# EAGLE design Shield STM32F407VET6 Mini - Reversed (EAGLE 8.2.0)
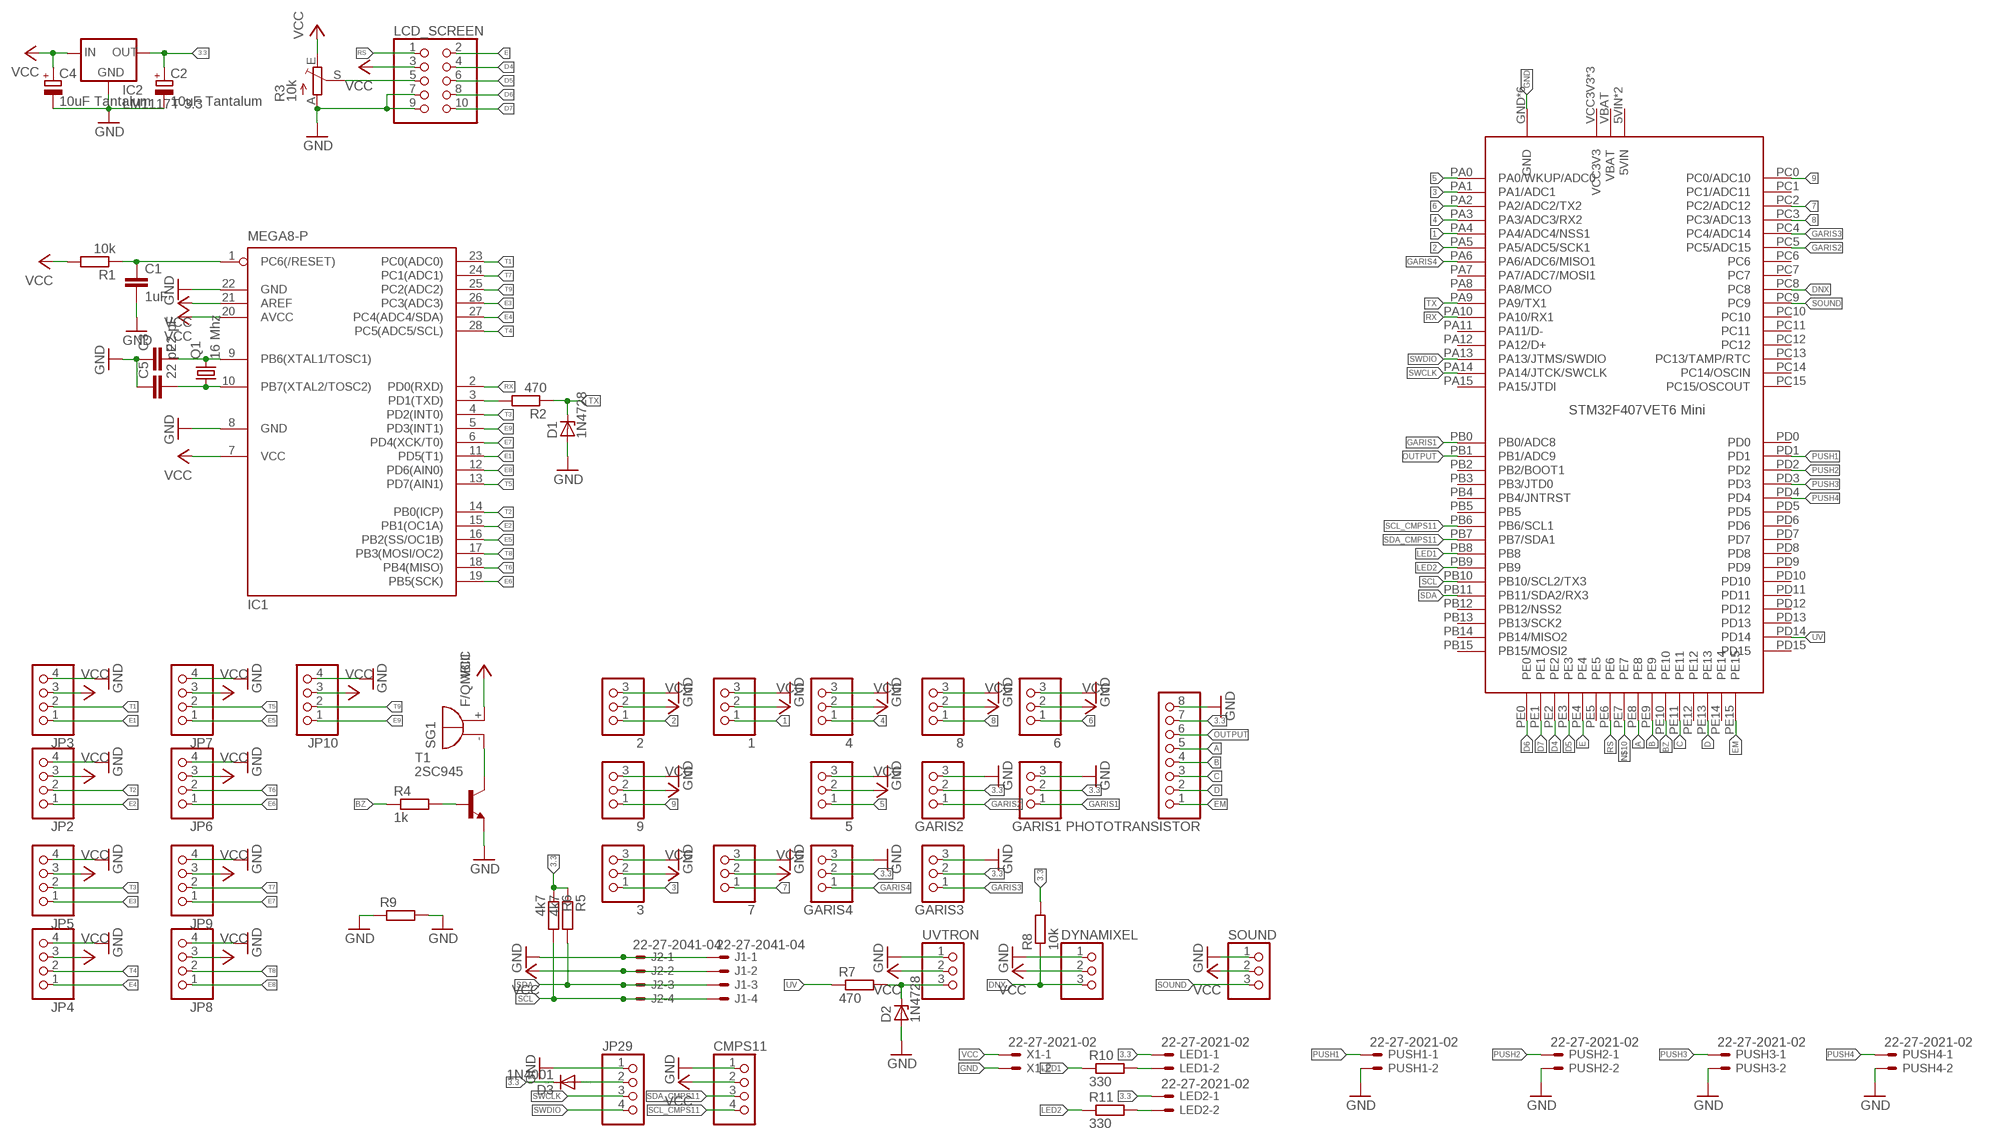
[diagram p0: schematic, sheet 1]

## Parts
1  PINHD-1X3  [1X03]
2  PINHD-1X3  [1X03]
3  PINHD-1X3  [1X03]
4  PINHD-1X3  [1X03]
5  PINHD-1X3  [1X03]
6  PINHD-1X3  [1X03]
7  PINHD-1X3  [1X03]
8  PINHD-1X3  [1X03]
9  PINHD-1X3  [1X03]
C1  1uF  C-EU025-025X050  [C025-025X050]
C2  10uF Tantalum  CPOL-EUE2.5-5  [E2,5-5]
C3  22 pF  C-EU025-025X050  [C025-025X050]
C4  10uF Tantalum  CPOL-EUE2.5-5  [E2,5-5]
C5  22 pF  C-EU025-025X050  [C025-025X050]
CMPS11  PINHD-1X4  [1X04]
D1  1N4728  ZENER-DIODEZD-7.5  [ZDIO-7.5]
D2  1N4728  ZENER-DIODEZD-7.5  [ZDIO-7.5]
D3  1N4001  BAS15  [DO34-7]
DYNAMIXEL  PINHD-1X3  [1X03]
GARIS1  PINHD-1X3  [1X03]
GARIS2  PINHD-1X3  [1X03]
GARIS3  PINHD-1X3  [1X03]
GARIS4  PINHD-1X3  [1X03]
IC1  MEGA8-P  [DIL28-3]
IC2  LM1117T-3.3  [TO220]
J1  22-27-2041-04  [6410-04]
J2  22-27-2041-04  [6410-04]
JP2  PINHD-1X4  [1X04]
JP3  PINHD-1X4  [1X04]
JP4  PINHD-1X4  [1X04]
JP5  PINHD-1X4  [1X04]
JP6  PINHD-1X4  [1X04]
JP7  PINHD-1X4  [1X04]
JP8  PINHD-1X4  [1X04]
JP9  PINHD-1X4  [1X04]
JP10  PINHD-1X4  [1X04]
JP29  PINHD-1X4  [1X04]
LCD_SCREEN  PINHD-2X5  [2X05]
LED1  22-27-2021-02  [6410-02]
LED2  22-27-2021-02  [6410-02]
PHOTOTRANSISTOR  PINHD-1X8  [1X08]
PUSH1  22-27-2021-02  [6410-02]
PUSH2  22-27-2021-02  [6410-02]
PUSH3  22-27-2021-02  [6410-02]
PUSH4  22-27-2021-02  [6410-02]
Q1  16 Mhz  CRYSTALHC49U70  [HC49U70]
R1  10k  R-EU_0204/7  [0204/7]
R2  470  R-EU_0204/7  [0204/7]
R3  10k  TRIM_EU-CA6V  [CA6V]
R4  1k  R-EU_0204/7  [0204/7]
R5  4k7  R-EU_0204/7  [0204/7]
R6  4k7  R-EU_0204/7  [0204/7]
R7  470  R-EU_0204/7  [0204/7]
R8  10k  R-EU_0204/7  [0204/7]
R9  R-EU_0204/5  [0204/5]
R10  330  R-EU_M1206  [M1206]
R11  330  R-EU_M1206  [M1206]
SG1  F/QMBIII  [F/QMBIII]
SOUND  PINHD-1X3  [1X03]
T1  2SC945  [TO92-ECB]
U$2  STM32F407VET6_MINI  [STM32F407VET6_MINI]
UVTRON  PINHD-1X3  [1X03]
X1  22-27-2021-02  [6410-02]

## Nets
1: 1.1 U$2.PA4(PA4/ADC4/NSS1)
2: 2.1 U$2.PA5(PA5/ADC5/SCK1)
3: 3.1 U$2.PA1(PA1/ADC1)
3.3: C2.+ D3.C GARIS1.2 GARIS2.2 GARIS3.2 GARIS4.2 IC2.2(OUT) LED1.1 LED2.1 PHOTOTRANSISTOR.7 R5.1 R6.1 R8.2
4: 4.1 U$2.PA3(PA3/ADC3/RX2)
5: 5.1 U$2.PA0(PA0/WKUP/ADC0)
6: 6.1 U$2.PA2(PA2/ADC2/TX2)
7: 7.1 U$2.PC2(PC2/ADC12)
8: 8.1 U$2.PC3(PC3/ADC13)
9: 9.1 U$2.PC0(PC0/ADC10)
A: PHOTOTRANSISTOR.5 U$2.PE8
B: PHOTOTRANSISTOR.4 U$2.PE9
BZ: R4.1 U$2.PE10
C: PHOTOTRANSISTOR.3 U$2.PE11
D: PHOTOTRANSISTOR.2 U$2.PE13
D4: LCD_SCREEN.4 U$2.PE2
D5: LCD_SCREEN.6 U$2.PE3
D6: LCD_SCREEN.8 U$2.PE0
D7: LCD_SCREEN.10 U$2.PE1
DNX: DYNAMIXEL.3 R8.1 U$2.PC8
E: LCD_SCREEN.2 U$2.PE4
E1: IC1.11(PD5(T1)) JP3.1
E2: IC1.15(PB1(OC1A)) JP2.1
E3: IC1.26(PC3(ADC3)) JP5.1
E4: IC1.27(PC4(ADC4/SDA)) JP4.1
E5: IC1.16(PB2(SS/OC1B)) JP7.1
E6: IC1.19(PB5(SCK)) JP6.1
E7: IC1.6(PD4(XCK/T0)) JP9.1
E8: IC1.12(PD6(AIN0)) JP8.1
E9: IC1.5(PD3(INT1)) JP10.1
EM: PHOTOTRANSISTOR.1 U$2.PE15
GARIS1: GARIS1.1 U$2.PB0(PB0/ADC8)
GARIS2: GARIS2.1 U$2.PC5(PC5/ADC15)
GARIS3: GARIS3.1 U$2.PC4(PC4/ADC14)
GARIS4: GARIS4.1 U$2.PA6(PA6/ADC6/MISO1)
GND: 1.3 2.3 3.3 4.3 5.3 6.3 7.3 8.3 9.3 C1.2 C2.- C3.1 C4.- C5.1 CMPS11.1 D1.A D2.A DYNAMIXEL.1 GARIS1.3 GARIS2.3 GARIS3.3 GARIS4.3 IC1.8(GND) IC1.22(GND) IC2.1(GND) J1.1 J2.1 JP2.4 JP3.4 JP4.4 JP5.4 JP6.4 JP7.4 JP8.4 JP9.4 JP10.4 JP29.1 LCD_SCREEN.7 LCD_SCREEN.9 PHOTOTRANSISTOR.8 PUSH1.2 PUSH2.2 PUSH3.2 PUSH4.2 R3.A R9.1 R9.2 SOUND.1 T1.E U$2.GND U$2.GND@1(GND) U$2.GND@2(GND) U$2.GND@3(GND) U$2.GND@4(GND) U$2.GND@5(GND) UVTRON.1 X1.2
LED1: R10.1 U$2.PB8
LED2: R11.1 U$2.PB9
N$1: C1.1 IC1.1(PC6(/RESET)) R1.1
N$2: D3.A JP29.2
N$3: C5.2 IC1.10(PB7(XTAL2/TOSC2)) Q1.1
N$4: C3.2 IC1.9(PB6(XTAL1/TOSC1)) Q1.2
N$5: LED1.2 R10.2
N$6: D2.C R7.2 UVTRON.3
N$7: LCD_SCREEN.5 R3.S
N$8: LED2.2 R11.2
N$10: U$2.PE7
N$16: SG1.-(+) T1.C
N$17: R4.2 T1.B
N$23: IC1.3(PD1(TXD)) R2.2
OUTPUT: PHOTOTRANSISTOR.6 U$2.PB1(PB1/ADC9)
PUSH1: PUSH1.1 U$2.PD1
PUSH2: PUSH2.1 U$2.PD2
PUSH3: PUSH3.1 U$2.PD3
PUSH4: PUSH4.1 U$2.PD4
RS: LCD_SCREEN.1 U$2.PE6
RX: IC1.2(PD0(RXD)) U$2.PA10(PA10/RX1)
SCL: J1.4 J2.4 R6.2 U$2.PB10(PB10/SCL2/TX3)
SCL_CMPS11: CMPS11.4 U$2.PB6(PB6/SCL1)
SDA: J1.3 J2.3 R5.2 U$2.PB11(PB11/SDA2/RX3)
SDA_CMPS11: CMPS11.3 U$2.PB7(PB7/SDA1)
SOUND: SOUND.3 U$2.PC9
SWCLK: JP29.3 U$2.PA14(PA14/JTCK/SWCLK)
SWDIO: JP29.4 U$2.PA13(PA13/JTMS/SWDIO)
T1: IC1.23(PC0(ADC0)) JP3.2
T2: IC1.14(PB0(ICP)) JP2.2
T3: IC1.4(PD2(INT0)) JP5.2
T4: IC1.28(PC5(ADC5/SCL)) JP4.2
T5: IC1.13(PD7(AIN1)) JP7.2
T6: IC1.18(PB4(MISO)) JP6.2
T7: IC1.24(PC1(ADC1)) JP9.2
T8: IC1.17(PB3(MOSI/OC2)) JP8.2
T9: IC1.25(PC2(ADC2)) JP10.2
TX: D1.C R2.1 U$2.PA9(PA9/TX1)
UV: R7.1 U$2.PD14
VCC: 1.2 2.2 3.2 4.2 5.2 6.2 7.2 8.2 9.2 C4.+ CMPS11.2 DYNAMIXEL.2 IC1.7(VCC) IC1.20(AVCC) IC1.21(AREF) IC2.3(IN) J1.2 J2.2 JP2.3 JP3.3 JP4.3 JP5.3 JP6.3 JP7.3 JP8.3 JP9.3 JP10.3 LCD_SCREEN.3 R1.2 R3.E SG1.+(-) SOUND.2 UVTRON.2 X1.1
Unconnected: U$2.5VIN U$2.5VIN@1(5VIN) U$2.PA7(PA7/ADC7/MOSI1) U$2.PA8(PA8/MCO) U$2.PA11(PA11/D-) U$2.PA12(PA12/D+) U$2.PA15(PA15/JTDI) U$2.PB2(PB2/BOOT1) U$2.PB3(PB3/JTD0) U$2.PB4(PB4/JNTRST) U$2.PB5 U$2.PB12(PB12/NSS2) U$2.PB13(PB13/SCK2) U$2.PB14(PB14/MISO2) U$2.PB15(PB15/MOSI2) U$2.PC1(PC1/ADC11) U$2.PC6 U$2.PC7 U$2.PC10 U$2.PC11 U$2.PC12 U$2.PC13(PC13/TAMP/RTC) U$2.PC14(PC14/OSCIN) U$2.PC15(PC15/OSCOUT) U$2.PD0 U$2.PD5 U$2.PD6 U$2.PD7 U$2.PD8 U$2.PD9 U$2.PD10 U$2.PD11 U$2.PD12 U$2.PD13 U$2.PD15 U$2.PE5 U$2.PE12 U$2.PE14 U$2.VBAT U$2.VCC3V3 U$2.VCC3V3@1(VCC3V3) U$2.VCC3V3@2(VCC3V3)

## Library data of the parts
1-9 DYNAMIXEL GARIS1-GARIS4 SOUND UVTRON = pinhead:PINHD-1X3: PIN HEADER
C1 C3 C5 = rcl:C-EU: CAPACITOR, European symbol
C2 C4 = rcl:CPOL-EU: POLARIZED CAPACITOR, European symbol
CMPS11 JP2-JP10 JP29 = pinhead:PINHD-1X4: PIN HEADER
D1 D2 = diode:ZENER-DIODE: Z-Diode
D3 = diode:BAS15: DIODE high speed
IC1 = atmel:MEGA8-P: MICROCONTROLLER 8 Kbytes FLASH, 1 kbytes SRAM, 512 bytes EEPROM, USART, 4-channel 10 bit ADC, 2-channel 8 bit ADC Pin compatible with Atmega48, ATMega88, ATMega168 Source: avr.lbr; OC_FARNELL: unknown; OC_NEWARK: unknown
IC2 = lm1117:LM1117T-*
J1 J2 = con-molex:22-?-04: CONNECTOR wire to board 2.54 mm (.1 inch) pitch header; OC_FARNELL: unknown; OC_NEWARK: unknown
LCD_SCREEN = pinhead:PINHD-2X5: PIN HEADER
LED1 LED2 PUSH1-PUSH4 X1 = con-molex:22-?-02: CONNECTOR wire to board 2.54 mm (.1 inch) pitch header; OC_FARNELL: unknown; OC_NEWARK: unknown
PHOTOTRANSISTOR = pinhead:PINHD-1X8: PIN HEADER
Q1 = crystal:CRYSTAL: CRYSTAL; OC_FARNELL: unknown; OC_NEWARK: unknown
R1 R2 R4-R11 = rcl:R-EU_: RESISTOR, European symbol
R3 = pot:TRIM_EU-: POTENTIOMETER
SG1 = buzzer:F/QMBIII: BUZZER Source: Buerklin; OC_FARNELL: unknown; OC_NEWARK: unknown
T1 = transistor:2SC945: NPN Silicon Epitaxial Planar Transistor Source: SEMTECH ELECTRONICS LTD. ... 2SC945 2.pdf
U$2 = STM32F407VET6-Mini:STM32F407VET6_MINI: STM32F407VET6 Mini

## Board
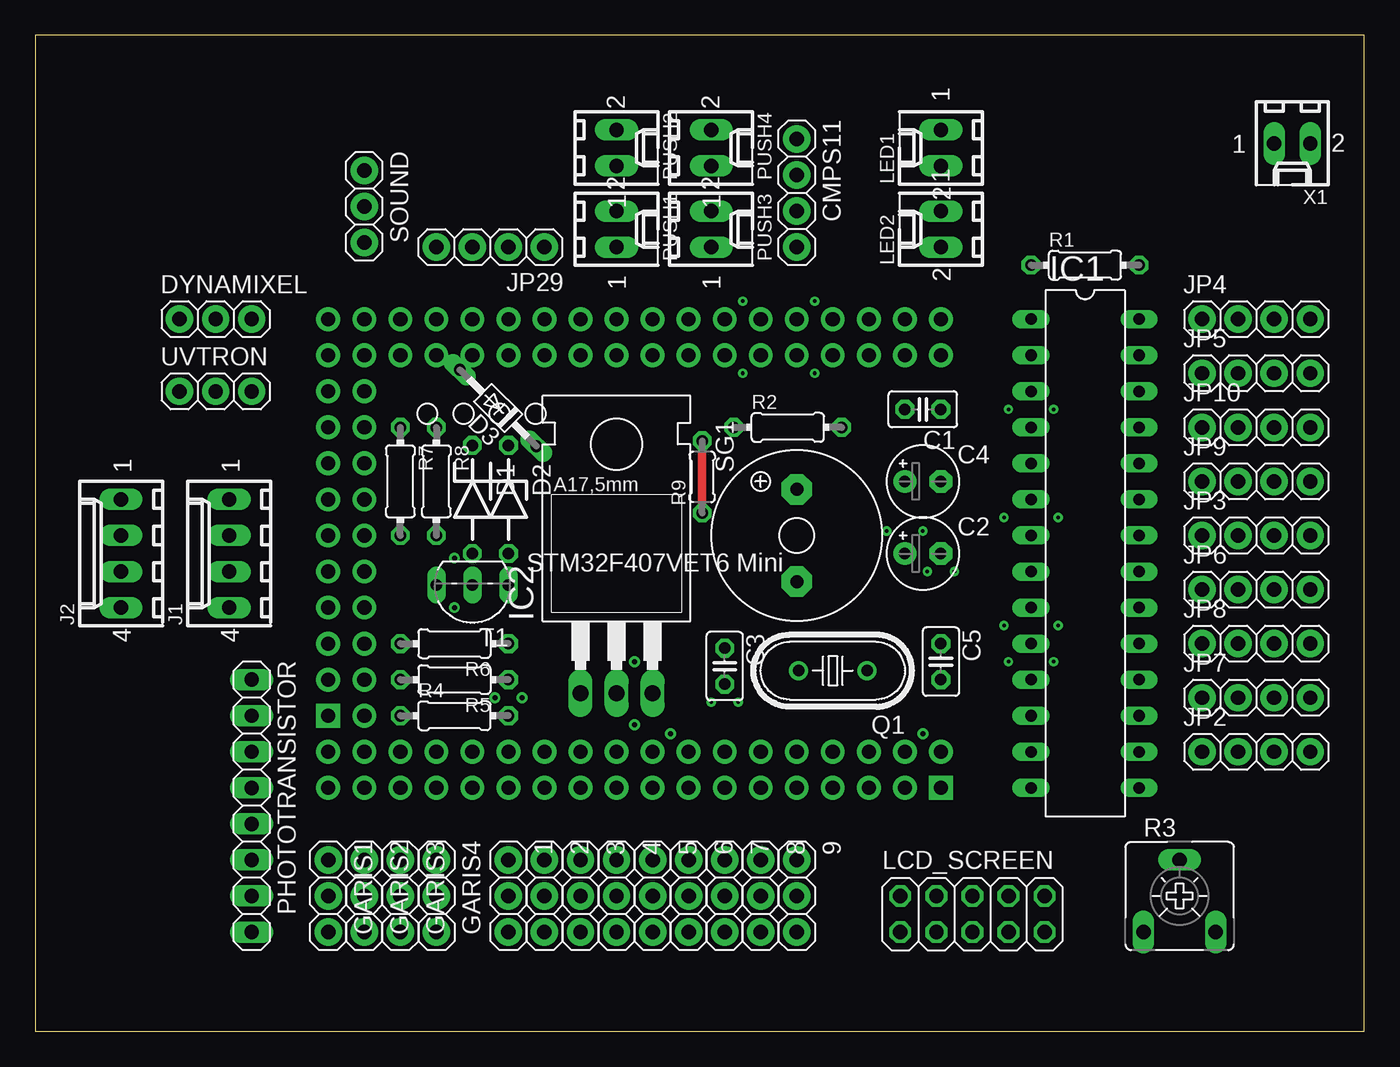
[diagram p1: board, top side]
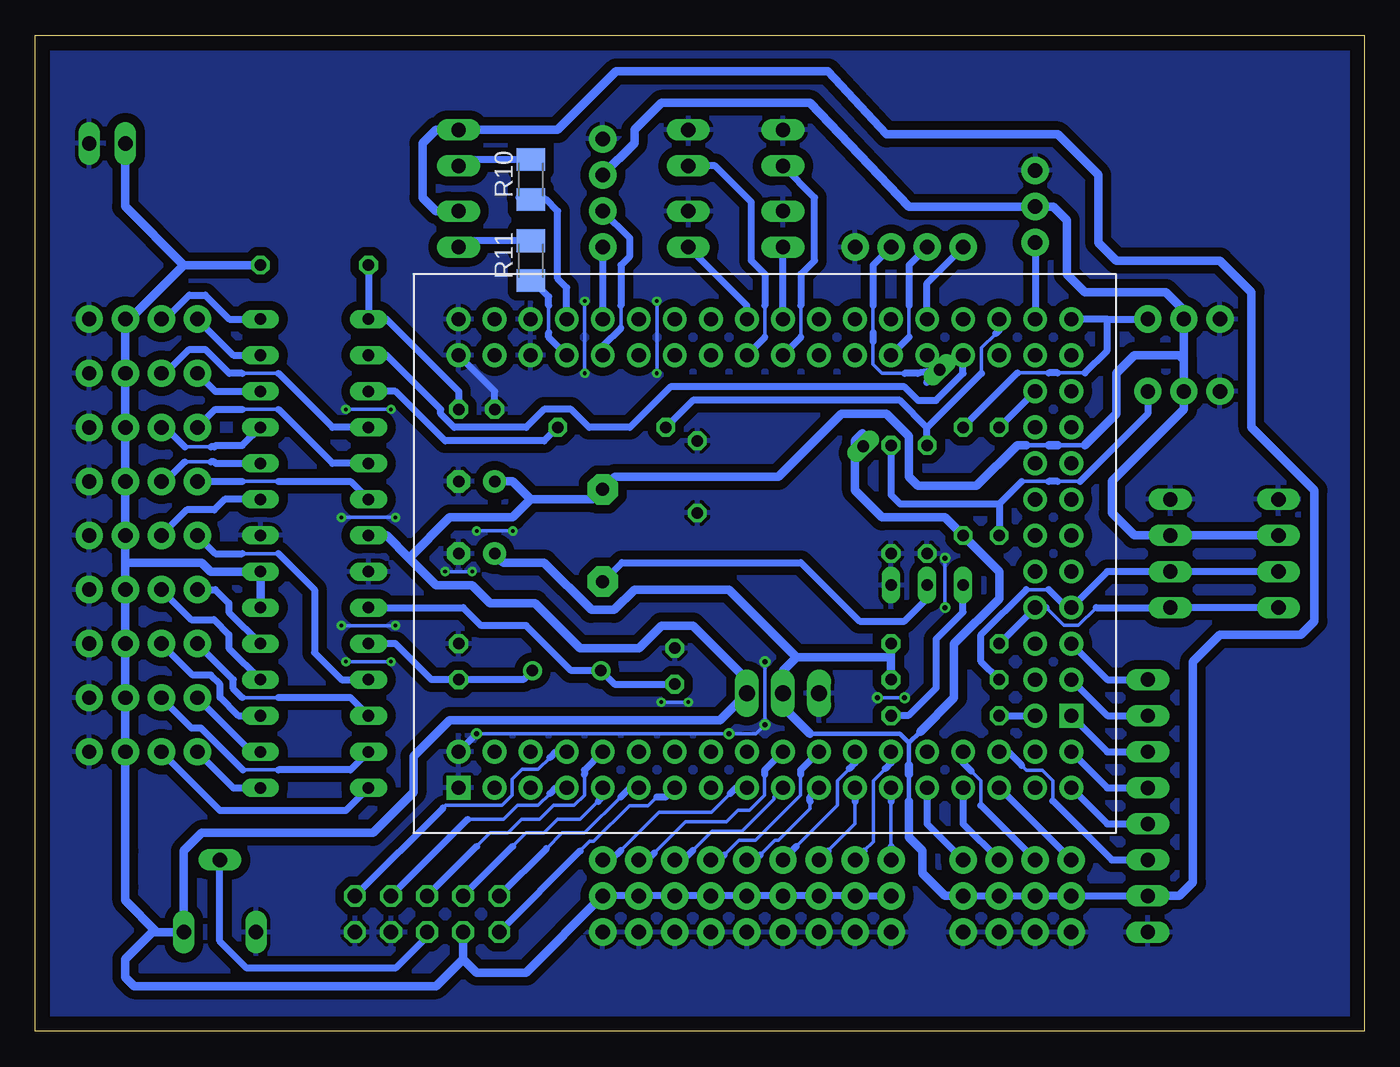
[diagram p2: board, bottom side, seen from below]

Size 93.64 x 70.16 mm. Coordinates in mm from the lower left corner, seen from the top.
Outline: 0,0 93.64,0 93.64,70.16 0,70.16 0,0
Copper layers (1*16): Top 0.035mm / dielectric 1.5mm / Bottom 0.035mm
Design rules "default *": minimum track width 6mil, minimum drill 0.35mm, track to track 6mil, track to pad 6mil, pad to pad 6mil, via to via 6mil, smd to smd 6mil, copper to edge 40mil, drill to drill 6mil, minimum pad ring 10mil, minimum via ring 8mil, stop-mask expansion 4mil, vias tented up to drill 0mil, thermal gap 10mil

### Footprints (pad centres in the part's own frame; a part is rotated, then mirrored left to right if it is on the bottom)
1X03 = drill 1.016 pad 1.93: 1 -2.54,0; 2 0,0; 3 2.54,0
C025-025X050 = drill 0.813 octagon: 1 -1.27,0; 2 1.27,0
E2,5-5 = drill 0.813 pad 1.6: + -1.27,0 | drill 0.813 pad 1.6 octagon: - 1.27,0
1X04 = drill 1.016 pad 1.93: 1 -3.81,0; 2 -1.27,0; 3 1.27,0; 4 3.81,0
ZDIO-7.5 = drill 0.813 octagon: A 3.81,0; C -3.81,0
DO34-7 = drill 0.813 long: A 3.81,0; C -3.81,0
DIL28-3 = drill 0.813 long: 1 -16.51,-3.81; 2 -13.97,-3.81; 3 -11.43,-3.81; 4 -8.89,-3.81; 5 -6.35,-3.81; 6 -3.81,-3.81; 7 -1.27,-3.81; 8 1.27,-3.81; 9 3.81,-3.81; 10 6.35,-3.81; 11 8.89,-3.81; 12 11.43,-3.81; 13 13.97,-3.81; 14 16.51,-3.81; 15 16.51,3.81; 16 13.97,3.81; 17 11.43,3.81; 18 8.89,3.81; 19 6.35,3.81; 20 3.81,3.81; 21 1.27,3.81; 22 -1.27,3.81; 23 -3.81,3.81; 24 -6.35,3.81; 25 -8.89,3.81; 26 -11.43,3.81; 27 -13.97,3.81; 28 -16.51,3.81
TO220 = drill 1.118 long: 1 -2.54,-6.35; 2 0,-6.35; 3 2.54,-6.35
6410-04 = drill 1.016 long: 1 3.81,0; 2 1.27,0; 3 -1.27,0; 4 -3.81,0
2X05 = drill 1.016 octagon: 1 -5.08,-1.27; 2 -5.08,1.27; 3 -2.54,-1.27; 4 -2.54,1.27; 5 0,-1.27; 6 0,1.27; 7 2.54,-1.27; 8 2.54,1.27; 9 5.08,-1.27; 10 5.08,1.27
6410-02 = drill 1.016 long: 1 1.27,0; 2 -1.27,0
1X08 = drill 1.016 long: 1 -8.89,0; 2 -6.35,0; 3 -3.81,0; 4 -1.27,0; 5 1.27,0; 6 3.81,0; 7 6.35,0; 8 8.89,0
HC49U70 = drill 0.813: 1 -2.413,0; 2 2.413,0
0204/7 = drill 0.813 octagon: 1 -3.81,0; 2 3.81,0
CA6V = drill 1.016 long: A -2.54,-2.54; E 2.54,-2.54; S 0,2.54
0204/5 = drill 0.813 octagon: 1 -2.54,0; 2 2.54,0
M1206 = smd 1.6 x 2: 1 -1.4,0; 2 1.4,0
F/QMBIII = drill 0.914 pad 2.159 octagon: + 3.251,0; - -3.251,0
TO92-ECB = drill 0.813 long: B 2.54,0; C 0,0; E -2.54,0
STM32F407VET6_MINI = drill 1 pad 1.676: 5VIN 16.51,-16.51; 5VIN@1 16.51,-13.97; GND@1 21.59,-13.97; GND@2 16.51,16.51; GND@3 16.51,13.97; GND@4 21.59,16.51; GND@5 21.59,13.97; PA0 -3.81,-16.51; PA1 -6.35,-16.51; PA2 -3.81,-13.97; PA3 -6.35,-13.97; PA4 -8.89,-16.51; PA5 -8.89,-13.97; PA6 -11.43,-16.51; PA7 -11.43,-13.97; PA8 -16.51,13.97; PA9 -16.51,16.51; PA10 -13.97,13.97; PA11 -13.97,16.51; PA12 -11.43,13.97; PA13 -11.43,16.51; PA14 -8.89,13.97; PA15 -8.89,16.51; PB0 -16.51,-16.51; PB1 -16.51,-13.97; PB2 -19.05,-16.51; PB3 6.35,13.97; PB4 8.89,16.51; PB5 8.89,13.97; PB6 11.43,16.51; PB7 11.43,13.97; PB8 13.97,16.51; PB9 13.97,13.97; PB10 -19.05,-3.81; PB11 -21.59,-3.81; PB12 -19.05,-1.27; PB13 -21.59,-1.27; PB14 -19.05,1.27; PB15 -21.59,1.27; PC0 1.27,-16.51; PC1 1.27,-13.97; PC2 -1.27,-16.51; PC3 -1.27,-13.97; PC4 -13.97,-16.51; PC5 -13.97,-13.97; PC6 -21.59,13.97; PC7 -19.05,13.97; PC8 -21.59,16.51; PC9 -19.05,16.51; PC10 -6.35,13.97; PC11 -6.35,16.51; PC12 -3.81,16.51; PC13 6.35,-13.97; PC14 3.81,-16.51; PC15 3.81,-13.97; PD0 -3.81,13.97; PD1 -1.27,16.51; PD2 -1.27,13.97; PD3 1.27,16.51; PD4 1.27,13.97; PD5 3.81,16.51; PD6 3.81,13.97; PD7 6.35,16.51; PD8 -19.05,3.81; PD9 -21.59,3.81; PD10 -19.05,6.35; PD11 -21.59,6.35; PD12 -19.05,8.89; PD13 -21.59,8.89; PD14 -19.05,11.43; PD15 -21.59,11.43; PE0 13.97,-16.51; PE1 13.97,-13.97; PE2 11.43,-16.51; PE3 11.43,-13.97; PE4 8.89,-16.51; PE5 8.89,-13.97; PE6 6.35,-16.51; PE7 -19.05,-13.97; PE8 -21.59,-16.51; PE9 -21.59,-13.97; PE10 -19.05,-11.43; PE12 -19.05,-8.89; PE13 -21.59,-8.89; PE14 -19.05,-6.35; PE15 -21.59,-6.35; VBAT 19.05,-16.51; VCC3V3 19.05,-13.97; VCC3V3@1 19.05,16.51; VCC3V3@2 19.05,13.97 | drill 1 pad 1.676 square: GND 21.59,-16.51; PE11 -21.59,-11.43

### Placement (x,y rotation side)
1  33.34,9.53 270 top
2  35.88,9.53 270 top
3  38.42,9.53 270 top
4  40.96,9.53 270 top
5  43.5,9.53 270 top
6  46.04,9.53 270 top
7  48.58,9.53 270 top
8  51.12,9.53 270 top
9  53.66,9.53 270 top
C1  62.55,43.81 180 top
C2  62.55,33.66 0 top
C3  48.58,25.72 270 top
C4  62.55,38.73 0 top
C5  63.82,26.04 270 top
CMPS11  53.66,59.05 270 top
D1  30.8,37.47 270 top
D2  33.34,37.47 270 top
D3  32.61,43.91 135 top
DYNAMIXEL  12.7,50.16 0 top
GARIS1  20.64,9.53 270 top
GARIS2  23.18,9.53 270 top
GARIS3  25.72,9.53 270 top
GARIS4  28.26,9.53 270 top
IC1  73.98,33.66 270 top
IC2  40.96,30.16 0 top
J1  13.65,33.66 90 top
J2  6.03,33.66 90 top
JP2  86.04,19.68 0 top
JP3  86.04,34.92 0 top
JP4  86.04,50.16 0 top
JP5  86.04,46.35 0 top
JP6  86.04,31.11 0 top
JP7  86.04,23.5 0 top
JP8  86.04,27.3 0 top
JP9  86.04,38.73 0 top
JP10  86.04,42.55 0 top
JP29  32.07,55.24 180 top
LCD_SCREEN  66.04,8.26 0 top
LED1  63.82,62.23 90 top
LED2  63.82,56.52 90 top
PHOTOTRANSISTOR  15.24,15.88 270 top
PUSH1  40.96,56.52 270 top
PUSH2  40.96,62.23 270 top
PUSH3  47.62,56.52 270 top
PUSH4  47.62,62.23 270 top
Q1  56.2,25.4 180 top
R1  73.98,53.98 0 top
R2  53.02,42.55 0 top
R3  80.64,9.53 0 top
R4  29.53,22.23 0 top
R5  29.53,24.77 180 top
R6  29.53,27.3 180 top
R7  25.72,38.73 270 top
R8  28.26,38.73 270 top
R9  46.99,39.05 90 top
R10  58.74,60.01 90 bottom
R11  58.74,54.29 90 bottom
SG1  53.66,34.92 90 top
SOUND  23.18,58.1 270 top
T1  30.8,31.43 180 top
U$2  42.23,33.66 0 top
UVTRON  12.7,45.09 0 top
X1  88.58,62.55 180 top

### Tracks (layer width: path | path; a pad name or v marks a point on that pad's centre or on a via)
1
  Bottom 0.254: 33.34,16.19 33.34,13.02
  Bottom 0.508: U$2.PA4 33.34,16.19 | 33.34,13.02 1.1
2
  Bottom 0.254: 33.74,18.5 34.58,17.66 34.58,13.36 35.24,12.7
  Bottom 0.508: U$2.PA5 33.34,18.91 33.74,18.5 | 35.24,12.7 2.1
3
  Bottom 0.254: 35.88,16.19 35.88,14.61 37.78,12.7
  Bottom 0.508: U$2.PA1 35.88,16.19 | 37.78,12.7 3.1
3.3
  Bottom 0.305: 39.05,20.95 32.7,20.95 32.07,20.32 | 32.07,18.73 32.07,20.32 | 32.07,20.32 31.27,21.11 | 32.07,18.1 32.07,16.19
  Bottom 0.508: GARIS4.2 GARIS3.2 GARIS2.2 GARIS1.2 PHOTOTRANSISTOR.7
  Bottom 0.61: 40.96,24.45 IC2.2 | C2.+ 60.64,33.02 57.78,33.02 54.45,29.69 52.86,29.69 51.44,31.11 44.77,31.11 40.01,26.35 | GARIS4.2 29.53,9.53 31.11,11.11 31.11,12.7 32.07,13.65 32.07,16.19 | D3.C 35.36,42.11 35.88,41.59 35.88,38.1 33.97,36.2 29.53,36.2 R8.2 25.72,32.38 25.72,30.48 28.89,27.3 28.89,23.5 31.27,21.11 | 32.07,18.73 32.07,18.1 | 39.05,20.95 40.96,22.86 IC2.2 | R6.1 33.34,26.35 | 33.34,26.35 R5.1 | 33.34,26.35 40.01,26.35 | IC2.2 40.96,25.4 40.01,26.35 | PHOTOTRANSISTOR.7 13.02,9.53 12.06,10.48 12.06,26.04 10.16,27.94 4.45,27.94 3.49,28.89 3.49,38.1 7.94,42.55 7.94,52.07 10.16,54.29 17.46,54.29 18.73,55.56 18.73,60.33 21.59,63.18 33.66,63.18 37.78,67.63 52.7,67.63 56.83,63.5 LED1.1 | 64.77,63.5 LED1.1 | LED1.1 65.41,63.5 66.36,62.55 66.36,58.74 65.41,57.78 LED2.1
4
  Bottom 0.254: 36.28,18.5 37.12,17.66 37.12,15.9 40.01,13.02
  Bottom 0.508: U$2.PA3 35.88,18.91 36.28,18.5 | 40.01,13.02 4.1
5
  Bottom 0.254: 42.56,12.4 41.53,13.44 41.27,13.44 39.05,15.66 39.05,16.19
  Bottom 0.508: U$2.PA0 39.05,16.51 39.05,16.19 | 5.1 42.9,12.06 42.56,12.4
6
  Bottom 0.254: 39.71,18.1 39.71,16.63 42.91,13.44 44.07,13.44 45.1,12.4
  Bottom 0.508: U$2.PA2 39.71,18.39 39.71,18.1 | 6.1 45.44,12.06 45.1,12.4
7
  Bottom 0.254: 41.27,16.83 41.59,16.51 41.59,16.36 43.85,14.1 45.95,14.1 47.33,12.72
  Bottom 0.508: 41.27,16.83 U$2.PC2 | 7.1 47.98,12.06 47.33,12.72
8
  Bottom 0.254: 42.25,18.1 42.25,16.63 43.33,15.56 44.13,15.56 44.93,14.76 47.83,14.76 50.02,12.56
  Bottom 0.508: U$2.PC3 42.25,18.39 42.25,18.1 | 8.1 50.52,12.06 50.02,12.56
9
  Bottom 0.254: 44.68,16.74 46.01,15.42 49.7,15.42 52.41,12.72
  Bottom 0.508: U$2.PC0 44.28,17.14 44.68,16.74 | 9.1 53.06,12.06 52.41,12.72
A
  Bottom 0.508: U$2.PE8 18.1,14.61 PHOTOTRANSISTOR.5
B
  Bottom 0.508: U$2.PE9 18.1,17.14 PHOTOTRANSISTOR.4
BZ
  Bottom 0.508: R4.1 U$2.PE10
C
  Bottom 0.508: U$2.PE11 18.1,19.68 PHOTOTRANSISTOR.3
D
  Bottom 0.508: U$2.PE13 18.1,22.23 PHOTOTRANSISTOR.2
D4
  Bottom 0.254: 53.98,16.19 55.24,14.92 56.83,14.92 57.78,13.97 59.05,13.97 60.01,13.02
  Bottom 0.508: U$2.PE2 53.66,16.51 53.98,16.19 | 60.01,13.02 LCD_SCREEN.4
D5
  Bottom 0.254: 54.95,18.1 54.95,16.63 55.68,15.9 57.12,15.9 58.1,14.92 59.37,14.92 60.33,13.97 61.59,13.97 62.55,13.02
  Bottom 0.508: U$2.PE3 54.95,18.39 54.95,18.1 | 62.55,13.02 LCD_SCREEN.6
D6
  Bottom 0.254: 57.38,16.74 58.22,15.9 59.66,15.9 60.64,14.92 63.18,14.92
  Bottom 0.508: U$2.PE0 56.98,17.14 57.38,16.74 | 63.18,14.92 LCD_SCREEN.8
D7
  Bottom 0.254: 57.38,19.28 58.22,18.44 59.35,18.44 60.03,17.75 60.03,16.63 60.76,15.9 64.75,15.9 64.93,15.72
  Bottom 0.508: U$2.PE1 56.98,19.68 57.38,19.28 | 64.93,15.72 LCD_SCREEN.10
DNX
  Bottom 0.254: 21.59,46.38 19.66,46.38 | 22.23,46.38 24.42,46.38
  Bottom 0.508: 18.1,50.16 U$2.PC8 | 18.1,50.16 DYNAMIXEL.3 | 19.66,46.38 18.1,47.94 18.1,50.16 | 21.59,46.38 22.23,46.38 | 24.42,46.38 R8.1
E
  Bottom 0.254: 52.39,16.51 54.93,13.97 56.52,13.97 57.63,12.86
  Bottom 0.508: U$2.PE4 51.75,17.14 52.39,16.51 | 57.63,12.86 LCD_SCREEN.2
E1
  Bottom 0.254: 79.06,33.66 76.52,33.66
  Bottom 0.508: 79.06,33.66 80.96,33.66 JP3.1 | IC1.11 72.07,24.77 73.98,26.67 73.98,31.11 76.52,33.66
E2
  Bottom 0.508: JP2.1 79.69,17.14 IC1.15
E3
  Bottom 0.508: JP5.1 80.96,45.09 IC1.26
E4
  Bottom 0.508: JP4.1 79.69,47.62 IC1.27
E5
  Bottom 0.508: JP7.1 78.42,19.68 IC1.16
E6
  Bottom 0.508: JP6.1 80.96,31.11 80.01,30.16 80.01,29.53 IC1.19
E7
  Bottom 0.254: 79.06,38.73 76.52,38.73
  Bottom 0.508: JP9.1 79.06,38.73 | 76.52,38.73 71.44,38.73 IC1.6
E8
  Bottom 0.254: 76.52,23.5 79.06,23.5
  Bottom 0.508: IC1.12 71.44,23.5 76.52,23.5 | 79.06,23.5 79.69,24.13 79.69,24.77 JP8.1
E9
  Bottom 0.254: 79.06,43.81 76.52,43.81
  Bottom 0.508: 79.06,43.81 80.96,43.81 JP10.1 | IC1.5 72.71,40.01 76.52,43.81
EM
  Bottom 0.508: U$2.PE15 18.1,24.77 PHOTOTRANSISTOR.1
GARIS1
  Bottom 0.508: U$2.PB0 GARIS1.1
GARIS2
  Bottom 0.254: 27.01,15.9 27.01,17.66 27.7,18.34
  Bottom 0.508: U$2.PC5 28.26,18.91 27.7,18.34 | GARIS2.1 27.01,15.9
GARIS3
  Bottom 0.508: U$2.PC4 28.26,14.61 GARIS3.1
GARIS4
  Bottom 0.508: U$2.PA6 30.8,14.61 GARIS4.1
GND  (via drill 0.25, 0.35)
  Top 0.61: R9.2 R9.1
  Bottom 0.254: v42.23,26.04 v42.23,21.59 42.86,20.95 v44.77,20.95 v62.55,20.95 | v68.26,28.57 v72.07,28.57 | v68.26,36.2 v72.07,36.2 | v47.62,23.18 v49.53,23.18 | v29.53,33.34 v29.53,29.84 | v32.38,23.5 v34.29,23.5 | v62.87,32.38 v64.77,32.38 | v60.01,35.24 v62.55,35.24 | v68.58,26.04 v71.75,26.04 | v68.58,43.81 v71.75,43.81 | v49.85,51.44 v49.85,46.35 | v54.93,51.44 v54.93,46.35
  Bottom 0.508: v62.55,20.95 U$2.GND@1 | C1.2 61.28,45.09 U$2.GND@5
  pour Bottom (isolate 0.61): 0.64,68.9 92.71,68.9 92.71,0.64 0.64,0.64
LED1
  Bottom 0.508: U$2.PB8 56.2,52.39 56.83,53.02 56.83,57.78 57.66,58.61 R10.1 59.56,58.74 58.42,58.74
LED2
  Bottom 0.254: 57.47,49.21 57.47,51.12
  Bottom 0.508: U$2.PB9 57.47,48.9 57.47,49.21 | 57.47,51.12 57.47,51.75 58.61,52.89 R11.1
N$1
  Bottom 0.508: R1.1 IC1.1 | IC1.1 68.9,50.16 | IC1.1 68.9,50.16 | 68.9,50.16 63.82,45.09 C1.1
N$2
  Bottom 0.254: 34.61,51.12 34.61,49.21 | 34.61,48.58 34.61,46.99 33.97,46.35 32.38,46.35
  Bottom 0.508: 30.83,45.72 D3.A 31.46,46.35 32.38,46.35 | JP29.2 34.61,53.98 34.61,51.12 | 34.61,49.21 34.61,48.58
N$3
  Bottom 0.508: Q1.1 59.24,24.77 C5.2 65.72,24.77 68.26,27.3 IC1.10
N$4
  Bottom 0.508: Q1.2 52.83,24.45 C3.2 | Q1.2 54.29,25.4 | IC1.9 63.5,29.84 62.23,28.57 59.05,28.57 55.88,25.4 Q1.2
N$5
  Bottom 0.508: R10.2 63.37,61.41 LED1.2
N$6
  Bottom 0.254: 21.59,38.73 20,38.73 | 22.23,38.73 24.13,38.73
  Bottom 0.508: 25.72,37.15 R7.2 | D2.C 33.34,37.78 32.7,37.15 25.72,37.15 | UVTRON.3 15.24,43.5 20,38.73 | 21.59,38.73 22.23,38.73 | 24.13,38.73 25.72,37.15
N$7
  Bottom 0.508: R3.S 80.64,6.35 78.74,4.45 68.26,4.45 66.04,6.67 LCD_SCREEN.5
N$8
  Bottom 0.508: R11.2 63.37,55.69 LED2.2
N$16
  Bottom 0.508: T1.C 30.8,30.48 32.38,28.89 35.56,28.89 39.69,33.02 52.31,33.02 SG1.-
N$17
  Bottom 0.508: 28.26,30.8 T1.B 28.26,29.53 30.16,27.62 30.16,24.18 32.12,22.23 R4.2
N$23
  Bottom 0.508: IC1.3 68.26,45.09 64.77,41.59 57.78,41.59 R2.2
OUTPUT
  Bottom 0.254: 21.93,16.22 21.93,17.66 22.66,18.39 23.79,18.39 24.13,18.73
  Bottom 0.508: U$2.PB1 25.08,19.68 24.13,18.73 | 21.93,16.22 17.78,12.06 PHOTOTRANSISTOR.6
PUSH1
  Bottom 0.508: U$2.PD1 PUSH1.1
PUSH2
  Bottom 0.254: 39.69,51.12 39.69,48.9
  Bottom 0.508: 39.69,48.9 U$2.PD2 | 39.69,51.12 39.69,53.34 38.73,54.29 38.73,58.74 PUSH2.1
PUSH3
  Bottom 0.508: U$2.PD3 43.5,51.12 PUSH3.1
PUSH4
  Bottom 0.254: 42.23,51.12 42.23,48.9
  Bottom 0.508: 42.23,48.9 U$2.PD4 | 42.23,51.12 42.23,53.34 43.18,54.29 43.18,58.42 45.73,60.97 PUSH4.1
RS
  Bottom 0.254: 49.85,16.51 50.48,15.88 51.79,15.88 54.29,13.37 54.58,13.37 55.24,12.7
  Bottom 0.508: 55.24,12.7 LCD_SCREEN.1 | U$2.PE6 49.21,16.51 49.85,16.51
RX
  Bottom 0.508: IC1.2 68.9,47.62 65.09,43.81 65.09,43.5 64.14,42.55 59.05,42.55 57.78,43.81 55.88,43.81 54.61,42.55 51.75,42.55 48.9,45.4 32.38,45.4 31.43,44.45 30.16,44.45 28.26,46.35 U$2.PA10
SCL
  Bottom 0.254: 22.4,29.84 21.15,28.6 20.12,28.6 18.88,29.84
  Bottom 0.508: R6.2 U$2.PB10 22.4,29.84 | 18.88,29.84 J1.4 J2.4
SCL_CMPS11
  Bottom 0.508: CMPS11.4 U$2.PB6
SDA
  Bottom 0.254: 22.23,31.11 23.81,31.11
  Bottom 0.508: 22.23,31.11 20.95,29.84 U$2.PB11 18.1,32.38 J1.3 J2.3 | R5.2 26.99,26.04 26.99,27.94 23.81,31.11
SDA_CMPS11
  Bottom 0.254: 52.39,51.12 52.39,49.53
  Bottom 0.508: U$2.PB7 53.66,48.26 52.39,49.53 | 52.39,51.12 52.39,53.98 51.75,54.61 51.75,55.88 CMPS11.3
SOUND
  Bottom 0.508: SOUND.3 U$2.PC9
SWCLK
  Bottom 0.254: 32.07,51.12 32.07,48.9
  Bottom 0.508: 32.07,48.9 U$2.PA14 | JP29.3 32.07,53.98 32.07,51.12
SWDIO
  Bottom 0.508: U$2.PA13 30.8,52.7 JP29.4
T1
  Bottom 0.508: IC1.23 80.29,37.47 81.03,36.73 82.97,36.73 JP3.2
T2
  Bottom 0.508: JP2.2 80.64,15.56 71.75,15.56 IC1.14
T3
  Bottom 0.254: 76.52,46.35 79.06,46.35
  Bottom 0.508: JP5.2 84.49,46.35 82.8,48.04 81.66,48.04 79.97,46.35 79.06,46.35 | IC1.4 72.71,42.55 76.52,46.35
T4
  Bottom 0.508: JP4.2 84.49,50.16 82.8,51.85 81.66,51.85 79.97,50.16 IC1.28
T5
  Bottom 0.254: 76.52,18.41 79.02,18.41
  Bottom 0.508: JP7.2 82.65,21.37 81.98,21.37 79.02,18.41 | 76.52,18.41 71.44,18.41 IC1.13
T6
  Bottom 0.508: JP6.2 82.65,28.99 81.06,28.99 80.01,27.94 80.01,26.99 IC1.18
T7
  Bottom 0.254: 81.28,40.11 83.12,40.11
  Bottom 0.508: 81.28,40.11 81.03,40.11 80.93,40.01 IC1.24 | JP9.2 84.49,38.73 83.12,40.11
T8
  Bottom 0.508: IC1.17 79.34,22.23 80.63,23.51 80.63,24.43 81.28,25.08 82.55,25.08 JP8.2
T9
  Bottom 0.254: 81.28,41.17 83.12,41.17
  Bottom 0.508: 81.28,41.17 81.03,41.17 80.93,41.27 79.06,41.27 IC1.25 | JP10.2 84.49,42.55 83.12,41.17
TX
  Bottom 0.254: 25.96,49.14 26.96,48.14 26.96,46.35
  Bottom 0.508: U$2.PA9 25.72,49.38 25.96,49.14 | 26.96,46.35 30.8,42.52 | D1.C 30.8,42.52 | 30.8,42.52 32.73,44.45 47.31,44.45 R2.1
UV
  Bottom 0.508: R7.1 U$2.PD14
VCC
  Bottom 0.305: 22.23,41.27 23.81,41.27 | 19.68,41.27 21.59,41.27
  Bottom 0.508: 1.2 2.2 3.2 4.2 5.2 6.2 7.2 8.2 9.2
  Bottom 0.61: JP4.3 87.31,49.85 | 87.31,49.85 JP5.3 JP10.3 JP9.3 JP3.3 87.31,33.02 | 87.31,33.02 JP6.3 JP8.3 JP7.3 JP2.3 87.32,19.68 87.31,12.7 87.31,10.16 87.31,9.21 85.09,6.99 | 83.19,53.98 R1.2 | 83.19,53.98 87.31,49.85 | 9.2 59.05,4.13 62.55,4.13 63.5,5.08 | IC1.7 68.9,34.92 67.31,33.34 | 58.74,37.47 54.37,37.47 SG1.+ 52.78,39.05 41.27,39.05 36.83,43.5 33.66,43.5 32.07,41.91 32.07,39.05 31.43,38.42 27.3,38.42 24.45,41.27 23.81,41.27 | 12.7,47.31 UVTRON.2 12.7,43.81 17.78,38.73 17.78,36.51 16.19,34.92 J1.2 J2.2 | 12.7,47.31 DYNAMIXEL.2 12.7,50.8 13.97,52.07 19.68,52.07 20.95,53.34 20.95,57.15 21.91,58.1 SOUND.2 32.07,58.1 39.05,65.41 49.53,65.41 51.44,63.5 51.44,62.55 CMPS11.2 | IC1.20 IC1.21 81.28,32.38 81.92,33.02 87.31,33.02 | 67.31,33.34 65.41,31.43 62.87,31.43 61.59,30.16 58.42,30.16 55.24,26.99 51.12,26.99 49.53,28.57 47.31,28.57 43.5,24.77 IC2.3 45.4,21.91 64.45,21.91 66.99,19.37 66.99,16.83 69.85,13.97 81.92,13.97 83.19,12.7 R3.E 85.09,6.99 | 58.74,37.47 60.01,36.2 64.45,36.2 67.31,33.34 | 21.59,41.27 22.23,41.27 | 19.68,41.27 17.46,43.5 17.46,46.35 16.19,47.62 13.02,47.62 12.7,47.31 | 63.5,5.08 LCD_SCREEN.3 | 63.5,5.08 65.41,3.17 86.68,3.17 87.31,3.81 87.31,5.08 85.41,6.99 85.09,6.99 | X1.1 87.32,58.11 83.19,53.98 | 58.74,37.47 60.01,38.73 C4.+